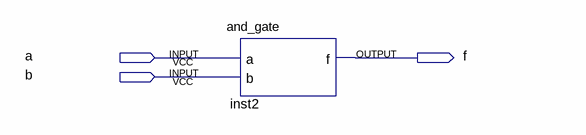
[diagram p0: schematic sheet]
// Quartus schematic text1.bdf as structural Verilog: 1 symbols, 3 pins
module text1 (
  input  a,
  input  b,
  output f
);

  and_gate inst2 (.a(a), .b(b), .f(f));
endmodule
